# EAGLE design Quadcopter (EAGLE 9.2.2)
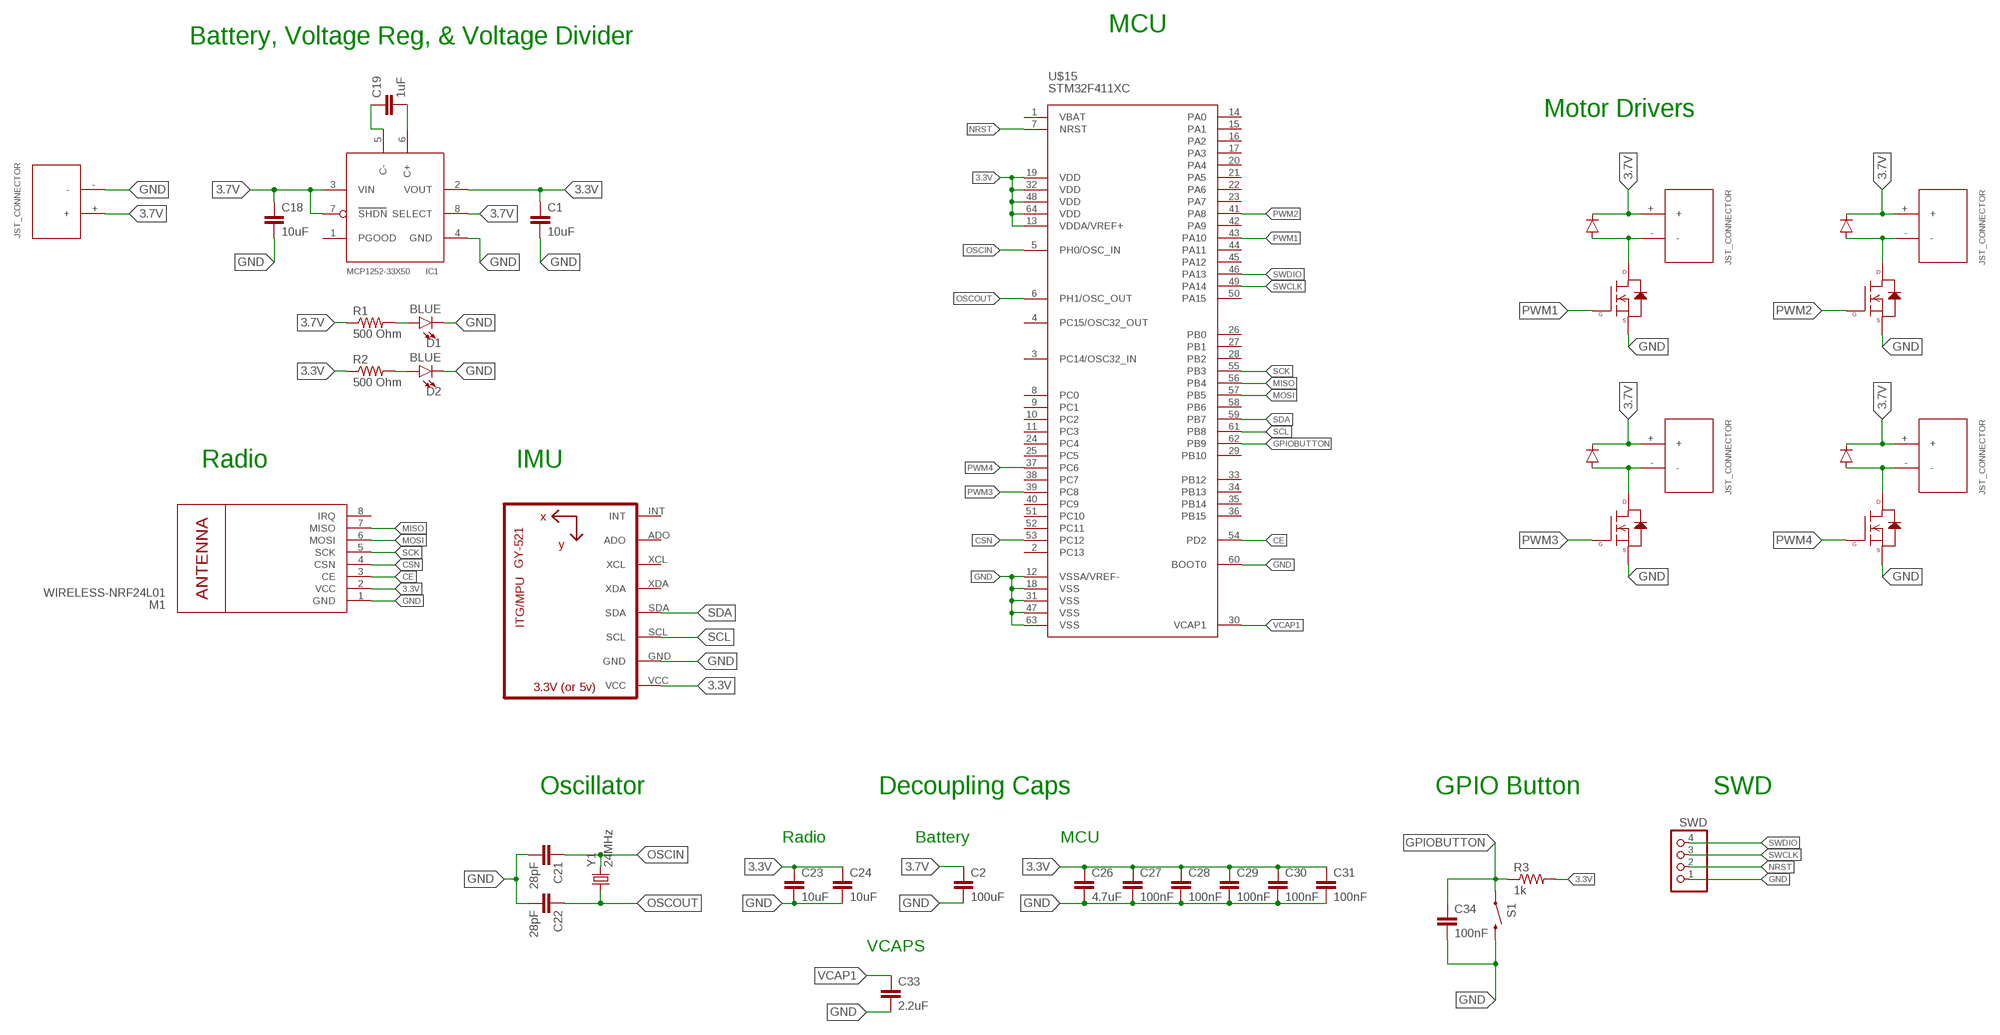
[diagram p0: schematic, sheet 1]

## Parts
C1  10uF  C-EUC0402K  [C0402K]
C2  100uF  C-EUC1206  [C1206]
C18  10uF  C-EUC0402K  [C0402K]
C19  1uF  C-EUC0402K  [C0402K]
C21  28pF  C-EUC0402K  [C0402K]
C22  28pF  C-EUC0402K  [C0402K]
C23  10uF  C-EUC0402K  [C0402K]
C24  10uF  C-EUC0402K  [C0402K]
C26  4.7uF  C-EUC0402K  [C0402K]
C27  100nF  C-EUC0402K  [C0402K]
C28  100nF  C-EUC0402K  [C0402K]
C29  100nF  C-EUC0402K  [C0402K]
C30  100nF  C-EUC0402K  [C0402K]
C31  100nF  C-EUC0402K  [C0402K]
C33  2.2uF  C-EUC0402K  [C0402K]
C34  100nF  C-EUC0402K  [C0402K]
D1  BLUE  LED-BLUE0603  [LED-0603]
D2  BLUE  LED-BLUE0603  [LED-0603]
IC1  MCP1252-33X50  [MSOP8]
JP1  SWD  PINHD-1X4  [1X04]
M1  WIRELESS-NRF24L01  [WIRELESS-NRF24L01]
R1  500 Ohm  R-US_R0402  [R0402]
R2  500 Ohm  R-US_R0402  [R0402]
R3  1k  R-US_R0402  [R0402]
S1  SWITCH-MOMENTARY-2SMD  [TACTILE-SWITCH-SMD]
U1  GY-521MPU6050  [GY-521]
U$2  JST_CONNECTOR_FEMALE  [JST_CONNECTOR_FEMALE]
U$3  JST_CONNECTOR_FEMALE  [JST_CONNECTOR_FEMALE]
U$4  JST_CONNECTOR_FEMALE  [JST_CONNECTOR_FEMALE]
U$5  N-CHANNEL-MOSFET-IRLML6244TRPBF  [SOT23-3]
U$6  DB2W40300L  [MINI2-F3-B]
U$7  JST_CONNECTOR_FEMALE  [JST_CONNECTOR_FEMALE]
U$8  N-CHANNEL-MOSFET-IRLML6244TRPBF  [SOT23-3]
U$9  DB2W40300L  [MINI2-F3-B]
U$10  N-CHANNEL-MOSFET-IRLML6244TRPBF  [SOT23-3]
U$11  JST_CONNECTOR_FEMALE  [JST_CONNECTOR_FEMALE]
U$12  N-CHANNEL-MOSFET-IRLML6244TRPBF  [SOT23-3]
U$13  DB2W40300L  [MINI2-F3-B]
U$14  DB2W40300L  [MINI2-F3-B]
U$15  STM32F411XC  [LQFP64]
Y1  24MHz  CRYSTALSMD  [HC49UP]

## Nets
3.3V: C1.1 C23.1 C24.1 C26.1 C27.1 C28.1 C29.1 C30.1 C31.1 IC1.2(VOUT) M1.2(VCC) R2.1 R3.2 U1.VCC U$15.13(VDDA/VREF+) U$15.19(VDD) U$15.32(VDD) U$15.48(VDD) U$15.64(VDD)
3.7V: C2.1 C18.1 IC1.3(VIN) IC1.7(SHDN) IC1.8(SELECT) R1.1 U$2.+ U$3.+ U$4.+ U$6.NEG(GPIN) U$7.+ U$9.NEG(GPIN) U$11.+ U$13.NEG(GPIN) U$14.NEG(GPIN)
CE: M1.3(CE) U$15.54(PD2)
CSN: M1.4(CSN) U$15.53(PC12)
GND: C1.2 C2.2 C18.2 C21.2 C22.2 C23.2 C24.2 C26.2 C27.2 C28.2 C29.2 C30.2 C31.2 C33.2 C34.2 D1.C D2.C IC1.4(GND) JP1.1 M1.1(GND) S1.3 U1.GND U$3.- U$5.2(S) U$8.2(S) U$10.2(S) U$12.2(S) U$15.12(VSSA/VREF-) U$15.18(VSS) U$15.31(VSS) U$15.47(VSS) U$15.60(BOOT0) U$15.63(VSS)
GPIOBUTTON: C34.1 R3.1 S1.1 U$15.62(PB9)
MISO: M1.7(MISO) U$15.56(PB4)
MOSI: M1.6(MOSI) U$15.57(PB5)
N$1: U$4.- U$10.3(D) U$14.POS(PPIN)
N$2: U$2.- U$5.3(D) U$6.POS(PPIN)
N$3: U$7.- U$8.3(D) U$9.POS(PPIN)
N$4: U$11.- U$12.3(D) U$13.POS(PPIN)
N$5: C19.1 IC1.5(C-)
N$6: C19.2 IC1.6(C+)
N$7: D1.A R1.2
N$8: D2.A R2.2
NRST: JP1.2 U$15.7(NRST)
OSCIN: C21.1 U$15.5(PH0/OSC_IN) Y1.2
OSCOUT: C22.1 U$15.6(PH1/OSC_OUT) Y1.1
PWM1: U$10.1(G) U$15.43(PA10)
PWM2: U$5.1(G) U$15.41(PA8)
PWM3: U$8.1(G) U$15.39(PC8)
PWM4: U$12.1(G) U$15.37(PC6)
SCK: M1.5(SCK) U$15.55(PB3)
SCL: U1.SCL U$15.61(PB8)
SDA: U1.SDA U$15.59(PB7)
SWCLK: JP1.3 U$15.49(PA14)
SWDIO: JP1.4 U$15.46(PA13)
VCAP1: C33.1 U$15.30(VCAP1)
Unconnected: IC1.1(PGOOD) M1.8(IRQ) U1.ADO U1.INT U1.XCL U1.XDA U$15.1(VBAT) U$15.2(PC13) U$15.3(PC14/OSC32_IN) U$15.4(PC15/OSC32_OUT) U$15.8(PC0) U$15.9(PC1) U$15.10(PC2) U$15.11(PC3) U$15.14(PA0) U$15.15(PA1) U$15.16(PA2) U$15.17(PA3) U$15.20(PA4) U$15.21(PA5) U$15.22(PA6) U$15.23(PA7) U$15.24(PC4) U$15.25(PC5) U$15.26(PB0) U$15.27(PB1) U$15.28(PB2) U$15.29(PB10) U$15.33(PB12) U$15.34(PB13) U$15.35(PB14) U$15.36(PB15) U$15.38(PC7) U$15.40(PC9) U$15.42(PA9) U$15.44(PA11) U$15.45(PA12) U$15.50(PA15) U$15.51(PC10) U$15.52(PC11) U$15.58(PB6)

## Notes on the sheet
- MCU
- Battery, Voltage Reg, & Voltage Divider
- Motor Drivers
- Radio | IMU
- Oscillator | Decoupling Caps | GPIO Button | SWD
- Radio | Battery | MCU
- VCAPS

## Library data of the parts
C1 C2 C18 C19 C21-C24 C26-C31 C33 C34 = resistor:C-EU: CAPACITOR, European symbol
D1 D2 = SparkFun-LED:LED-BLUE: Blue SMD LED Used in manufacturing of various products at SparkFun Packages: 0603 - SMD 0603 package [Product Link] <http://www.digikey.com/product-detail/en/SMLE12BC7TT86/511-1589-2-ND/1641808> 1206 - SMD1206 package [Product Link] <http://www.digikey.com/product-detail/en/lite-on-inc/LTST-C150TBKT/160-1643-1-ND/573584> SparkFun Products: ESP8266 Thing-Dev Board <https://www.sparkfun.com/products/13711> RedBoard <https://www.sparkfun.com/products/12757>; PROD_ID: DIO-08575
IC1 = microchip-MCP125x-xxx:MCP1252-33X50: 650KHz 3.3V / 5.0V Selectable Switching Regulator
JP1 = pinhead:PINHD-1X4: PIN HEADER
M1 = quad:WIRELESS-NRF24L01: 2.4 GHz Wireless Module based on NRF24L01 chip
R1-R3 = resistor:R-US_: RESISTOR, American symbol
S1 = quad:SWITCH-MOMENTARY-2: Various NO switches- pushbuttons, reed, etc; PROD_ID: SWCH-08247
U1 = quad:GY-521
U$2-U$4 U$7 U$11 = quad:JST_CONNECTOR_FEMALE
U$5 U$8 U$10 U$12 = quad:N-CHANNEL-MOSFET: N-Channel MOSFET Mode Field Effect Transistor; DATASHEET: http://www.mouser.com/ds/2/196/irlml6244pbf-936666.pdf; MOUSER: 942-IRLML6244TRPBF; URL: http://www.mouser.com/Search/ProductDetail.aspx?R=IRLML6244TRPBFvirtualkey57370000virtualkey942-IRLML6244TRPBF
U$6 U$9 U$13 U$14 = quad:DB2W40300L
U$15 = stm32f411:STM32F411XC
Y1 = quad:CRYSTAL: Crystals Various standard crystals. Proven footprints. Spark Fun Electronics SKU : COM-00534

## Board
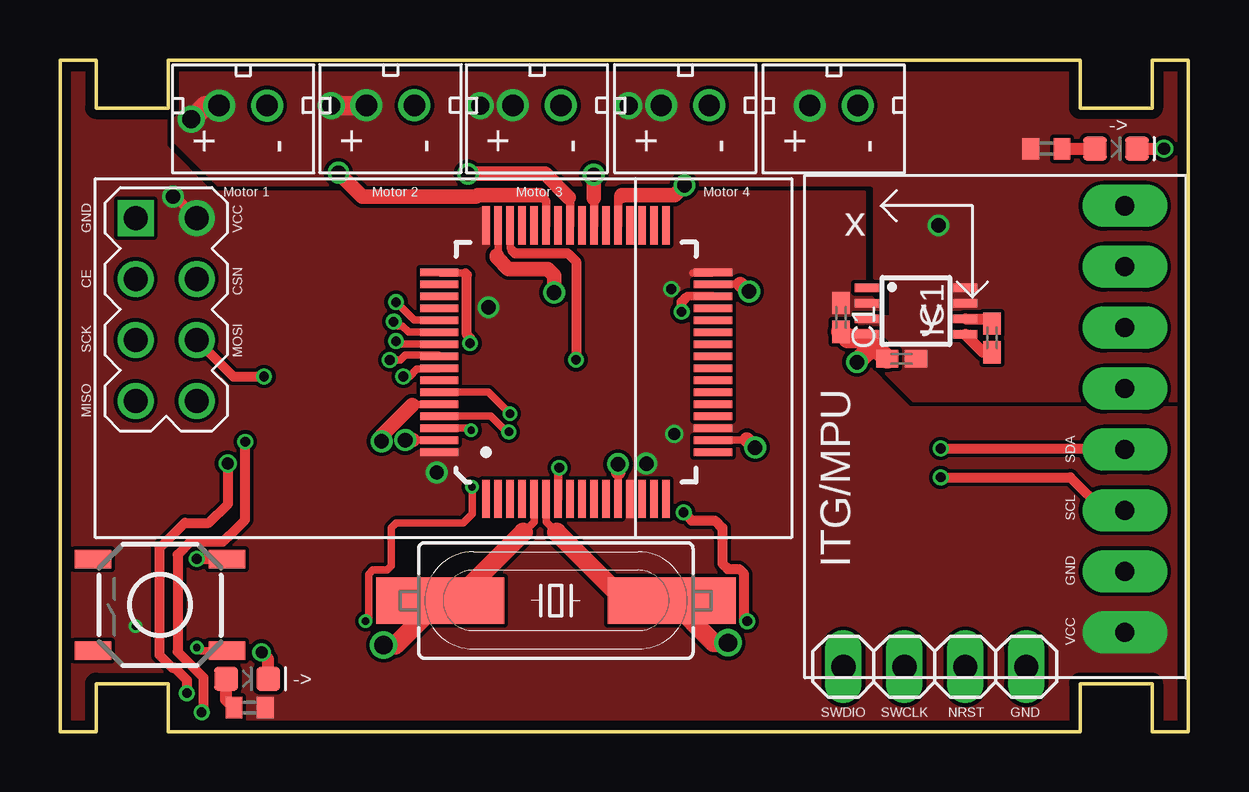
[diagram p1: board, top side]
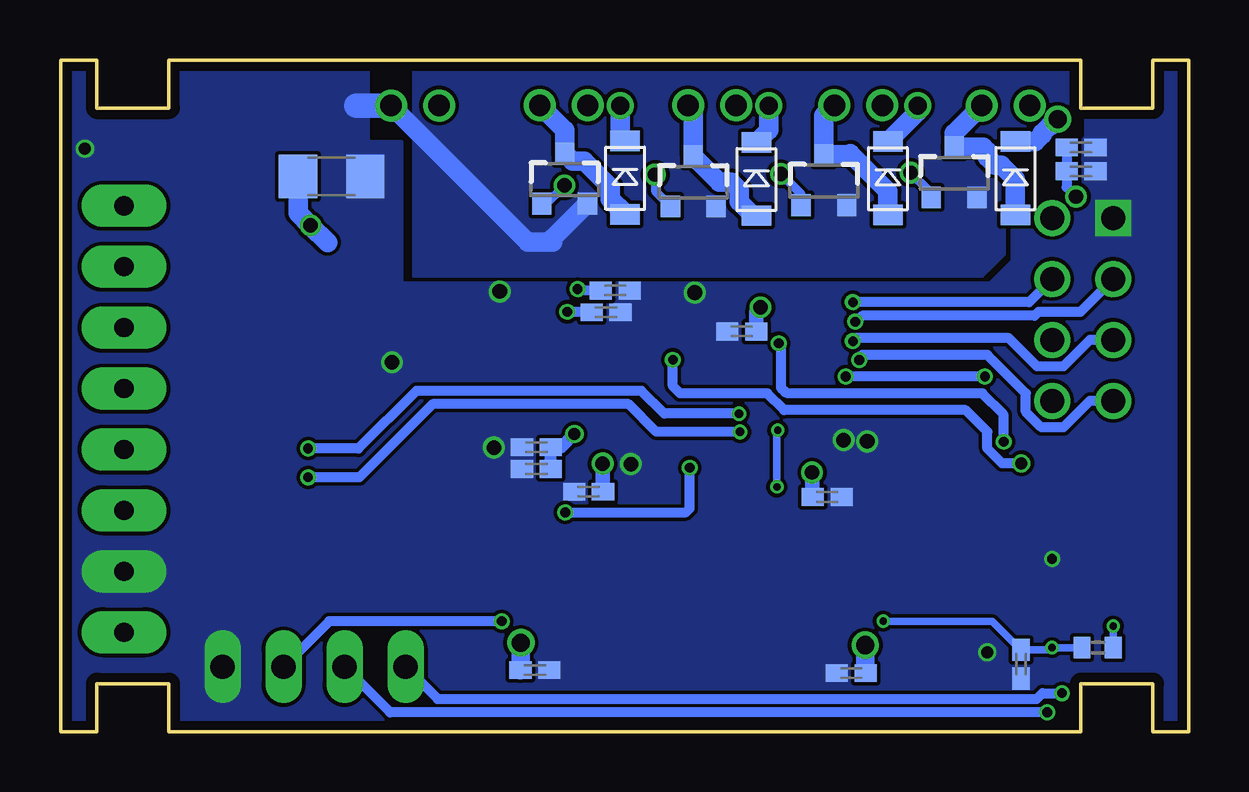
[diagram p2: board, bottom side, seen from below]

Size 47 x 28 mm. Coordinates in mm from the lower left corner, seen from the top.
Outline: 0,0 0,28 1.5,28 1.5,26 4.5,26 4.5,28 42.5,28 42.5,26 45.5,26 45.5,28 47,28 47,0 45.5,0 45.5,2 42.5,2 42.5,0 4.5,0 4.5,2 1.5,2 1.5,0 0,0
Copper layers (1*16): Top 0.035559375mm / dielectric 1.6mm / Bottom 0.035559375mm
Design rules "oshpark-2layer": minimum track width 6mil, minimum drill 10mil, track to track 6mil, track to pad 6mil, pad to pad 6mil, via to via 6mil, smd to smd 6mil, copper to edge 15mil, drill to drill 6mil, minimum pad ring 5mil, minimum via ring 5mil, stop-mask expansion 2.5mil, vias tented up to drill 0mil, thermal gap 10mil

### Footprints (pad centres in the part's own frame; a part is rotated, then mirrored left to right if it is on the bottom)
C0402K = smd 0.925 x 0.74: 1 -0.6,0; 2 0.6,0
C1206 = smd 1.6 x 1.8: 1 -1.4,0; 2 1.4,0
LED-0603 = smd 1 x 1: A -0.877,0; C 0.877,0
MSOP8 = smd 0.35 x 1: 1 -0.975,-2.05; 2 -0.325,-2.05; 3 0.325,-2.05; 4 0.975,-2.05; 5 0.975,2.05; 6 0.325,2.05; 7 -0.325,2.05; 8 -0.975,2.05
1X04 = drill 1.016 long: 1 -3.81,0; 2 -1.27,0; 3 1.27,0; 4 3.81,0
WIRELESS-NRF24L01 = drill 1 square: 1 -12.7,6.35 | drill 1: 2 -10.16,6.35; 3 -12.7,3.81; 4 -10.16,3.81; 5 -12.7,1.27; 6 -10.16,1.27; 7 -12.7,-1.27; 8 -10.16,-1.27
R0402 = smd 0.7 x 0.9: 1 -0.65,0; 2 0.65,0
TACTILE-SWITCH-SMD = smd 1.524 x 0.762: 1 -2.794,1.905; 2 2.794,1.905; 3 -2.794,-1.905; 4 2.794,-1.905
GY-521 = drill 0.8 pad 1.778 long: ADO -8.89,-6.35; GND -8.89,6.35; INT -8.89,-8.89; SCL -8.89,3.81; SDA -8.89,1.27; VCC -8.89,8.89; XCL -8.89,-3.81; XDA -8.89,-1.27
JST_CONNECTOR_FEMALE = drill 0.889: + 0,1; - 0,-1
SOT23-3 = smd 0.8 x 0.9: 1 -0.95,-1; 2 0.95,-1; 3 0,1.1
MINI2-F3-B = smd 1.22 x 0.85: NEG 0,1.55; POS 0,-1.5
LQFP64 = smd 0.3 x 1.6: 1 -3.75,-5.7; 2 -3.25,-5.7; 3 -2.75,-5.7; 4 -2.25,-5.7; 5 -1.75,-5.7; 6 -1.25,-5.7; 7 -0.75,-5.7; 8 -0.25,-5.7; 9 0.25,-5.7; 10 0.75,-5.7; 11 1.25,-5.7; 12 1.75,-5.7; 13 2.25,-5.7; 14 2.75,-5.7; 15 3.25,-5.7; 16 3.75,-5.7; 33 3.75,5.7; 34 3.25,5.7; 35 2.75,5.7; 36 2.25,5.7; 37 1.75,5.7; 38 1.25,5.7; 39 0.75,5.7; 40 0.25,5.7; 41 -0.25,5.7; 42 -0.75,5.7; 43 -1.25,5.7; 44 -1.75,5.7; 45 -2.25,5.7; 46 -2.75,5.7; 47 -3.25,5.7; 48 -3.75,5.7 | smd 1.6 x 0.3: 17 5.7,-3.75; 18 5.7,-3.25; 19 5.7,-2.75; 20 5.7,-2.25; 21 5.7,-1.75; 22 5.7,-1.25; 23 5.7,-0.75; 24 5.7,-0.25; 25 5.7,0.25; 26 5.7,0.75; 27 5.7,1.25; 28 5.7,1.75; 29 5.7,2.25; 30 5.7,2.75; 31 5.7,3.25; 32 5.7,3.75; 49 -5.7,3.75; 50 -5.7,3.25; 51 -5.7,2.75; 52 -5.7,2.25; 53 -5.7,1.75; 54 -5.7,1.25; 55 -5.7,0.75; 56 -5.7,0.25; 57 -5.7,-0.25; 58 -5.7,-0.75; 59 -5.7,-1.25; 60 -5.7,-1.75; 61 -5.7,-2.25; 62 -5.7,-2.75; 63 -5.7,-3.25; 64 -5.7,-3.75
HC49UP = smd 5.334 x 1.93: 1 -4.826,0; 2 4.826,0

### Placement (x,y rotation side)
C1  32.54,17.27 270 top
C2  35.72,23.15 0 bottom
C18  35.07,15.54 180 top
C19  38.83,16.41 90 top
C21  14.07,2.44 180 bottom
C22  27.25,2.56 0 bottom
C23  4.49,24.35 0 bottom
C24  4.49,23.36 0 bottom
C26  27.19,10.95 180 bottom
C27  27.19,11.85 180 bottom
C28  25.01,10 180 bottom
C29  23.9,18.39 0 bottom
C30  18.63,16.68 180 bottom
C31  15.07,9.78 0 bottom
C33  24.28,17.48 0 bottom
C34  7,2.81 270 bottom
D1  44,24.3 0 top
D2  7.8,2.2 0 top
IC1  35.67,17.53 270 top
JP1  36.45,2.7 180 top
M1  15.85,15.06 0 top
R1  41.1,24.3 0 top
R2  7.9,1 180 top
R3  3.8,3.5 0 bottom
S1  4.17,5.28 180 top
U1  35.48,13.03 180 top
U$2  13.77,26.11 90 top
U$3  32.24,26.1 90 top
U$4  7.63,26.1 90 top
U$5  15.21,22.95 0 bottom
U$6  12.54,23.05 0 bottom
U$7  19.87,26.11 90 top
U$8  20.65,22.9 0 bottom
U$9  18.02,23.01 0 bottom
U$10  9.78,23.27 0 bottom
U$11  26.05,26.11 90 top
U$12  26.01,23.01 0 bottom
U$13  23.49,23.07 0 bottom
U$14  7.23,23.05 0 bottom
U$15  21.5,15.4 0 top
Y1  20.66,5.46 180 top

### Tracks (layer width: path | path; a pad name or v marks a point on that pad's centre or on a via)
3.3V  (via drill 0.3, 0.41, 0.5, 0.6, 0.61)
  Top 0.305: 25.7,18.45 v25.47,18.45 | 27.19,19.12 26.36,19.12 | v15.7,10.8 15.67,10.8
  Top 0.406: v4.7,22.3 4.8,22.3 M1.2
  Bottom 0.305: R3.2 v3.15,4.4
  Bottom 0.406: C23.1 C24.1 5.09,22.69 v4.7,22.3 | C29.1 25.41,18.39 v25.47,18.45
  Bottom 0.508: C26.1 C27.1 26.15,11.85 v25.6,12.4
  Bottom 0.61: 26.56,10.98 C26.1 | v24.43,11.17 24.43,10.02 C28.1 | v15.7,10.8 15.7,9.81 C31.1 | v17.85,17.68 18.03,17.5 C30.1
  pour Top (no thermals): 1.3,0.2 1.3,2.2 4.7,2.2 4.7,0.2 42.3,0.2 42.3,2.2 45.7,2.2 45.7,0.2 46.8,0.2 46.8,13.5 35.4,13.5 33,15.9 33,17.6 34.3,17.6 33.5,18.4 33.5,22.5 6.3,22.5 4.4,24.4 4.4,25.8 1.3,25.8 1.3,27.7 1.3,27.8 0.2,27.8 0.2,0.2
3.7V  (via drill 0.6, 0.75)
  Top 0.813: v5.47,25.53 6.04,26.1 U$4.+ | v11.3,26.1 U$2.+
  Bottom 0.813: U$6.NEG 11.3,25.84 v11.3,26.1 | U$14.NEG 6.4,24.6 6.11,24.89 6.11,24.95 5.78,25.28 5.72,25.28 v5.47,25.53 | U$9.NEG 17.5,25.08 v17.5,26.1 | U$13.NEG 23.7,24.83 v23.7,26.1 | C2.1 37.12,21.62 v36.6,21.1 35.89,20.39
  pour Top (no thermals): 4.84,27.8 4.84,24.54 6.57,22.81 33.81,22.81 33.94,22.68 33.94,18.9 34.62,18.9 34.62,17.28 33.32,17.28 33.32,16.04 35.55,13.81 46.82,13.81 46.82,27.7 45.92,27.7 45.92,25.8 42.42,25.8 42.42,27.8
CE  (via drill 0.41)
  Top 0.305: v13.9,17.09 14.08,16.91 14.26,16.91 14.52,16.65 U$15.54
  Bottom 0.406: M1.3 4.52,17.5 6.27,17.5 6.43,17.34 13.6,17.34 13.85,17.09 v13.9,17.09
CSN  (via drill 0.41)
  Top 0.305: v14,17.9 14.75,17.15 U$15.53
  Bottom 0.406: M1.4 6.66,17.9 v14,17.9
GND  (via drill 0.41, 0.51, 0.6, 0.61)
  Top 0.305: U$15.31 28.34,18.65 | U$15.12 23.25,10.8 | U$15.63 14.7,12.15 | U$15.60 15.78,13.63 14.69,13.63 14.68,13.62 | 28.62,12.18 28.59,12.15 U$15.18 | U$15.47 18.25,19.91 18.19,19.85
  Top 0.406: S1.3 5.71,7.18 v5.7,7.2
  Top 0.457: IC1.4 33.62,16.39
  Top 0.508: D1.C v46,24.3 | D2.C 8.68,3.02 v8.4,3.3
  Top 0.61: v28.71,18.35 28.64,18.35 28.34,18.65 | 23.25,10.8 v23.25,11.15 | 14.7,12.15 v14.39,12.15 | v13.4,12.1 13.4,12.35 14.68,13.62 | 28.62,12.18 v28.96,11.84 | v20.59,18.3 20.59,19.01 20.32,19.28 18.68,19.28 18.19,19.77 18.19,19.85
  Top 0.813: 33.62,16.39 C18.2 | C1.2 32.82,16.39 33.62,16.39 | 33.62,16.39 33.62,15.82 v33.2,15.4
  Bottom 0.813: U$12.2 26.5,20.57 26.5,20.4 27.54,20.4 U$3.-
  Bottom 1.016: U$3.- 34.7,26.1
  pour Bottom (no thermals): 32.3,27.8 32.3,19 8.6,19 7.7,19.9 7.7,22 4.7,25 4.7,27.8
  pour Bottom (no thermals): 34.2,27.8 34.2,24.6 32.8,24.6 32.8,18.69 8.3,18.69 7.36,19.63 7.36,21.74 4.3,24.8 4.3,25.7 4.2,25.8 1.3,25.8 1.3,27.8 0.2,27.8 0.2,0.2 1.3,0.2 1.3,2.2 4.7,2.2 4.7,0.2 42.3,0.2 42.3,2.2 45.7,2.2 45.7,0.2 46.8,0.2 46.8,27.8 45.7,27.8 45.7,25.8 42.3,25.8 42.3,27.8
GPIOBUTTON  (via drill 0.3)
  Top 0.305: S1.1 5.83,3.38 v5.7,3.5 | v12.73,4.6 12.86,4.73 12.86,6.55 13.04,6.73 13.63,6.73 13.8,6.9 13.8,8.5 14,8.7 16.8,8.7 17.17,9.07 v17.17,10.2 | v17.13,12.57 17.05,12.65 U$15.62
  Bottom 0.305: v12.73,4.6 8.19,4.6 C34.1 5.79,3.41 v5.7,3.5 R3.1 | v17.17,10.2 17.17,12.53 v17.13,12.57
MISO  (via drill 0.41)
  Top 0.305: v13.74,15.49 14.19,15.49 14.39,15.69 15.76,15.69 U$15.56
  Bottom 0.406: M1.7 4.13,13.79 5.23,12.68 6.15,12.68 6.8,13.33 6.8,14.1 8.4,15.7 13.6,15.7 13.74,15.56 v13.74,15.49
MOSI  (via drill 0.41)
  Top 0.305: U$15.57 15.76,15.11 14.87,15.11 14.57,14.8 v14.3,14.8
  Top 0.406: M1.6 7.22,14.8 v8.5,14.8
  Bottom 0.406: v8.5,14.8 v14.3,14.8
N$1
  Bottom 0.813: U$4.- 9.78,24.95 U$10.3 8.57,24.37 8.4,24.2 8.4,23.94 8.07,23.62 7.82,23.62 7.23,23.03 U$14.POS
N$2
  Bottom 0.813: U$2.- 15.21,25.67 U$5.3 14.15,24.05 14.1,24.1 12.54,22.54 12.54,22 U$6.POS
N$3
  Bottom 0.813: U$7.- 20.65,25.89 U$8.3 19.56,22.91 19.07,22.91 18.74,22.58 18.74,22.09 18.16,21.51 U$9.POS
N$4
  Bottom 0.813: U$11.- 26.01,25.07 U$12.3 25.68,23.77 25.18,23.77 24.1,22.69 24.1,22.2 23.49,21.59 U$13.POS
N$5
  Top 0.457: IC1.5 38.47,15.81 C19.1
N$6
  Top 0.457: IC1.6 38.63,17.2 C19.2
N$7
  Top 0.508: R1.2 D1.A
N$8
  Top 0.508: R2.2 6.92,1.33 D2.A
NRST  (via drill 0.41)
  Top 0.356: U$15.7 20.75,10.95 v20.8,11
  Top 0.406: v28.64,4.6 28.51,4.73 28.51,6.57 28.3,6.78 27.82,6.78 27.6,7 27.6,8.5 27.3,8.8 26.32,8.8 v25.98,9.14
  Bottom 0.406: v25.98,9.14 20.96,9.14 20.8,9.3 v20.8,11 | v28.64,4.6 35.82,4.6 JP1.2
OSCIN  (via drill 0.76)
  Top 0.305: U$15.5 19.75,8.75 19.3,8.3
  Top 0.762: Y1.2 13.97,3.6 v13.48,3.6
  Top 0.813: Y1.2 16.46,5.46 19.3,8.3
  Bottom 0.762: v13.48,3.6 13.48,2.45 C21.1
OSCOUT  (via drill 0.76)
  Top 0.305: U$15.6 20.25,8.75 20.7,8.3
  Top 0.762: Y1.1 27.25,3.7 v27.84,3.7
  Top 0.813: Y1.1 23.54,5.46 20.7,8.3
  Bottom 0.762: v27.84,3.7 27.84,2.58 C22.1
PWM1  (via drill 0.6)
  Top 0.356: U$15.43 20.25,22.11 20,22.36
  Top 0.61: v11.6,23.3 12.6,22.3 17.35,22.3 17.41,22.36 20,22.36
  Bottom 0.356: U$10.1 10.84,22.27 10.84,22.54 v11.6,23.3
PWM2  (via drill 0.6)
  Top 0.356: U$15.41 21.25,22.23 21.21,22.27
  Top 0.61: v17,23.25 20.23,23.25 21.21,22.27
  Bottom 0.356: v17,23.25 16.16,22.41 U$5.1
PWM3  (via drill 0.6)
  Top 0.356: U$15.39 22.25,22.21 22.23,22.23
  Top 0.457: 22.23,22.23 22.24,22.24
  Top 0.61: v22.24,23.22 22.24,22.24
  Bottom 0.356: v22.24,23.22 22.24,22.54 U$8.1
PWM4  (via drill 0.6)
  Top 0.356: U$15.37 23.25,22.2 23.38,22.32
  Top 0.61: 23.38,22.32 23.41,22.36 25.61,22.36 v26.02,22.77
  Bottom 0.356: v26.02,22.77 26.77,22.01 U$12.1
SCK  (via drill 0.41)
  Top 0.305: v14,16.27 14.12,16.15 U$15.55
  Bottom 0.406: M1.5 4.13,16.33 5.23,15.22 6.32,15.22 7.5,16.4 13.87,16.4 v14,16.27
SCL  (via drill 0.36, 0.41)
  Top 0.305: U$15.61 17.95,13.15 18.61,12.49 v18.7,12.49
  Top 0.406: v36.7,10.6 42.1,10.6 43.5,9.2 44.35,9.2 U1.SCL
  Bottom 0.406: v18.7,12.49 22.19,12.49 23.35,13.65 31.51,13.65 34.56,10.6 v36.7,10.6
SDA  (via drill 0.36, 0.41)
  Top 0.305: v18.75,13.25 17.85,14.15 U$15.59
  Top 0.406: v36.7,11.8 44.33,11.8 U1.SDA
  Bottom 0.406: v18.75,13.25 21.85,13.25 22.81,14.21 32.19,14.21 34.6,11.8 v36.7,11.8
SWCLK  (via drill 0.41)
  Top 0.305: U$15.49 15.85,19.11 16.89,19.11 16.9,19.1
  Top 0.406: v7.71,12.09 7.71,8.82 7.03,8.14 7.02,8.14 6.8,7.92 5.45,7.92 4.9,7.37 4.9,3.32 5.97,2.25 5.97,0.87 v5.9,0.8 | v17.09,16.19 17.09,16.41 16.96,16.54 16.96,19.04 16.9,19.1
  Bottom 0.406: v17.09,16.19 17,16.1 17,14.33 16.82,14.15 16.78,14.15 16.73,14.1 8.6,14.1 7.71,13.21 v7.71,12.09 | JP1.3 33.28,0.8 v5.9,0.8
SWDIO  (via drill 0.41, 0.5)
  Top 0.305: U$15.46 18.75,20.15 18.85,20.05
  Top 0.406: v6.98,11.18 7,11.16 7,9.5 6.2,8.7 5.2,8.7 4.14,7.64 4.14,3.19 4.67,2.66 4.77,2.66 5.29,2.15 v5.29,1.6 | 18.85,20.05 18.95,19.94 21.16,19.94 21.5,19.6 v21.5,15.5
  Bottom 0.406: v6.98,11.18 7.78,11.18 8.4,11.8 8.4,12.5 9.3,13.4 16.86,13.4 17.56,14.1 21.2,14.1 21.5,14.4 v21.5,15.5 | JP1.4 31.3,1.36 6.34,1.36 6.1,1.6 v5.29,1.6
VCAP1  (via drill 0.41)
  Top 0.356: U$15.30 26.14,18.15 26.04,18.06
  Top 0.406: v25.9,17.5 25.9,17.91 26.04,18.06
  Bottom 0.406: C33.1 25.88,17.48 v25.9,17.5

### Text on the board
tPlace: -> | Motor 1 | Motor 2 | Motor 3 | Motor 4 | ->
tNames: GND | VCC | CE | CSN | SCK | MOSI | MISO | SDA | SCL | GND | VCC | SWDIO | SWCLK | NRST | GND